# EAGLE schematic Radio Console-AS ORDERED 2015-05-06 (EAGLE 7.2.0)

## Sheet 1 of 4: Operators
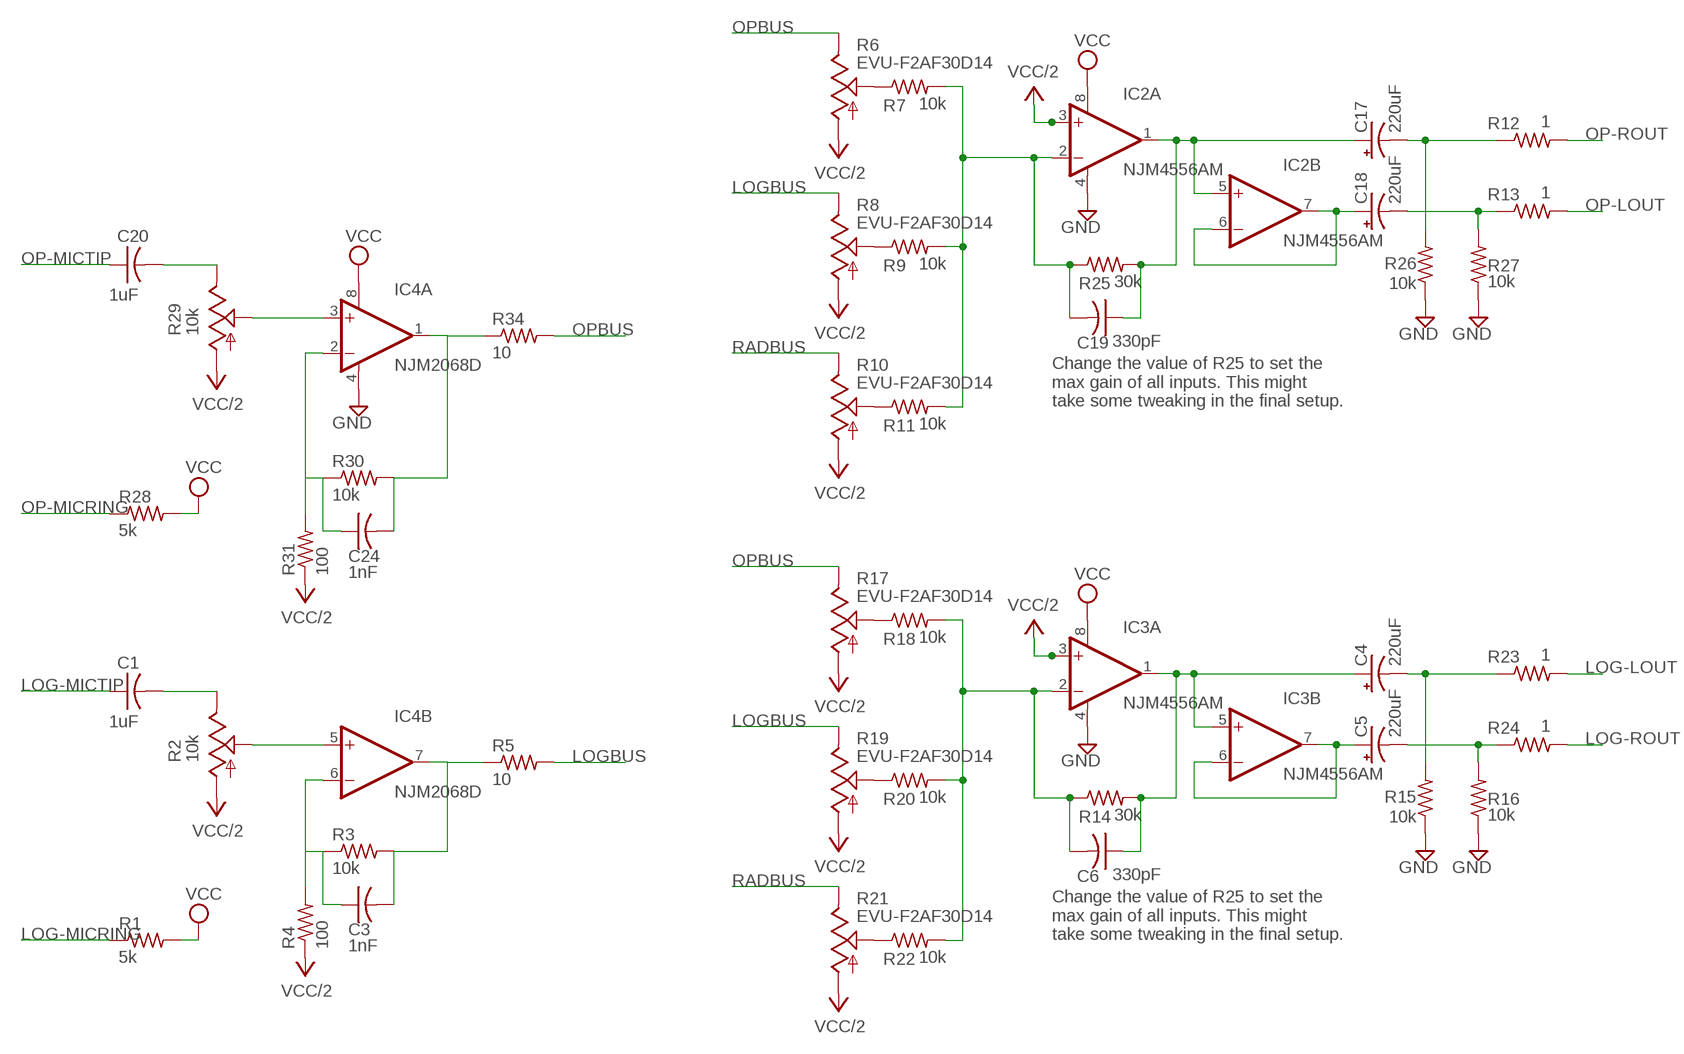
[diagram p0: schematic, sheet 1]

### Parts
C1  1uF  C-USC1206  [C1206]
C3  1nF  C-USC1206  [C1206]
C4  220uF  CPOL-USE5-8.5  [E5-8,5]
C5  220uF  CPOL-USE5-8.5  [E5-8,5]
C6  330pF  C-USC1206  [C1206]
C17  220uF  CPOL-USE5-8.5  [E5-8,5]
C18  220uF  CPOL-USE5-8.5  [E5-8,5]
C19  330pF  C-USC1206  [C1206]
C20  1uF  C-USC1206  [C1206]
C24  1nF  C-USC1206  [C1206]
IC2  NJM4556AM  OPA2131U  [SO08]
IC3  NJM4556AM  OPA2131U  [SO08]
IC4  NJM2068D  OPA2131U  [SO08]
R1  5k  R-US_R1206  [R1206]
R2  10k  TRIM_US-S64W  [S64W]
R3  10k  R-US_R1206  [R1206]
R4  100  R-US_R1206  [R1206]
R5  10  R-US_R1206  [R1206]
R6  EVU-F2AF30D14  US-EVUF2M  [EVUFXM]
R7  10k  R-US_R1206  [R1206]
R8  EVU-F2AF30D14  US-EVUF2M  [EVUFXM]
R9  10k  R-US_R1206  [R1206]
R10  EVU-F2AF30D14  US-EVUF2M  [EVUFXM]
R11  10k  R-US_R1206  [R1206]
R12  1  R-US_R1206  [R1206]
R13  1  R-US_R1206  [R1206]
R14  30k  R-US_R1206  [R1206]
R15  10k  R-US_R1206  [R1206]
R16  10k  R-US_R1206  [R1206]
R17  EVU-F2AF30D14  US-EVUF2M  [EVUFXM]
R18  10k  R-US_R1206  [R1206]
R19  EVU-F2AF30D14  US-EVUF2M  [EVUFXM]
R20  10k  R-US_R1206  [R1206]
R21  EVU-F2AF30D14  US-EVUF2M  [EVUFXM]
R22  10k  R-US_R1206  [R1206]
R23  1  R-US_R1206  [R1206]
R24  1  R-US_R1206  [R1206]
R25  30k  R-US_R1206  [R1206]
R26  10k  R-US_R1206  [R1206]
R27  10k  R-US_R1206  [R1206]
R28  5k  R-US_R1206  [R1206]
R29  10k  TRIM_US-S64W  [S64W]
R30  10k  R-US_R1206  [R1206]
R31  100  R-US_R1206  [R1206]
R34  10  R-US_R1206  [R1206]

### Nets
GND: IC2.4(A:V-) IC3.4(A:V-) IC4.4(A:V-) R15.1 R16.1 R26.1 R27.1 ; also sheet 2,3,4
LOG-LOUT: R23.2 ; also sheet 2
LOG-MICRING: R1.1 ; also sheet 2
LOG-MICTIP: C1.1 ; also sheet 2
LOG-ROUT: R24.2 ; also sheet 2
LOGBUS: R5.2 R8.3(E) R19.3(E) ; also sheet 3,4
N$1: C1.2 R2.E
N$2: IC4.5(B:+IN) R2.S
N$3: C3.1 IC4.6(B:-IN) R3.1 R4.2
N$4: C3.2 IC4.7(B:OUT) R3.2 R5.1
N$6: R6.2(S) R7.1
N$7: R8.2(S) R9.1
N$8: R10.2(S) R11.1
N$9: C17.- R12.1 R26.2
N$10: C18.- R13.1 R27.2
N$11: C6.2 IC3.2(A:-IN) R14.1 R18.2 R20.2 R22.2
N$13: C19.2 IC2.2(A:-IN) R7.2 R9.2 R11.2 R25.1
N$15: R17.2(S) R18.1
N$16: R19.2(S) R20.1
N$17: C20.2 R29.E
N$18: R21.2(S) R22.1
N$19: C4.- R15.2 R23.1
N$20: C5.- R16.2 R24.1
N$29: C24.1 IC4.2(A:-IN) R30.1 R31.2
N$30: C24.2 IC4.1(A:OUT) R30.2 R34.1
N$45: C4.+ C6.1 IC3.1(A:OUT) IC3.5(B:+IN) R14.2
N$46: C17.+ C19.1 IC2.1(A:OUT) IC2.5(B:+IN) R25.2
N$48: C18.+ IC2.6(B:-IN) IC2.7(B:OUT)
N$52: C5.+ IC3.6(B:-IN) IC3.7(B:OUT)
N$62: IC4.3(A:+IN) R29.S
OP-LOUT: R13.2 ; also sheet 2
OP-MICRING: R28.1 ; also sheet 2
OP-MICTIP: C20.1 ; also sheet 2
OP-ROUT: R12.2 ; also sheet 2
OPBUS: R6.3(E) R17.3(E) R34.2 ; also sheet 3,4
RADBUS: R10.3(E) R21.3(E) ; also sheet 3,4
VCC: IC2.8(A:V+) IC3.8(A:V+) IC4.8(A:V+) R1.2 R28.2 ; also sheet 2,3,4
VCC/2: IC2.3(A:+IN) IC3.3(A:+IN) R2.A R4.1 R6.1(A) R8.1(A) R10.1(A) R17.1(A) R19.1(A) R21.1(A) R29.A R31.1 ; also sheet 2,3,4

### Notes on the sheet
- Change the value of R25 to set the
  max gain of all inputs. This might 
  take some tweaking in the final setup.
- Change the value of R25 to set the
  max gain of all inputs. This might 
  take some tweaking in the final setup.

## Sheet 2 of 4: Connectors
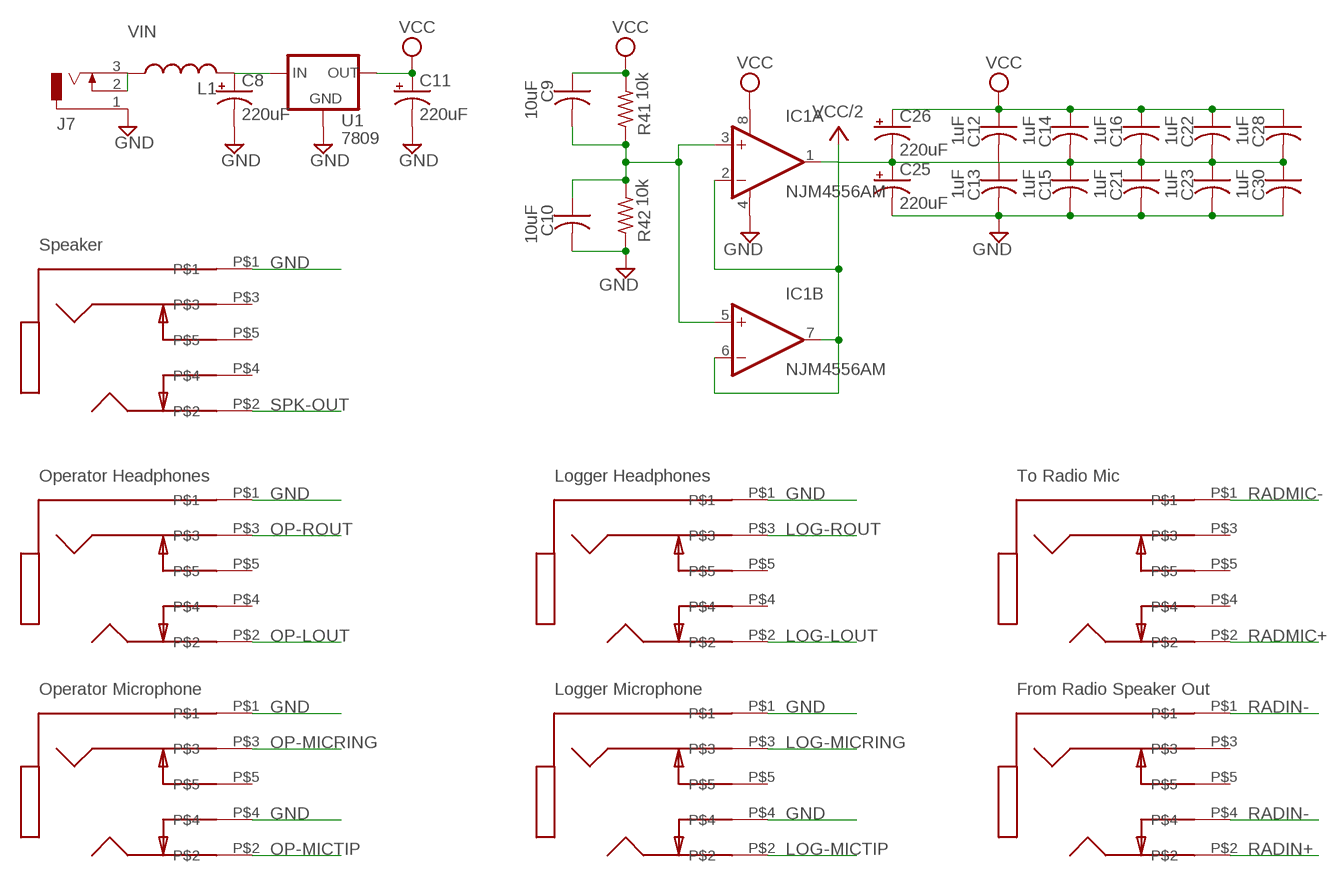
[diagram p1: schematic, sheet 2]

### Parts
C8  220uF  CPOL-USE5-8.5  [E5-8,5]
C9  10uF  C-USC1206  [C1206]
C10  10uF  C-USC1206  [C1206]
C11  220uF  CPOL-USE5-8.5  [E5-8,5]
C12  1uF  C-USC1206  [C1206]
C13  1uF  C-USC1206  [C1206]
C14  1uF  C-USC1206  [C1206]
C15  1uF  C-USC1206  [C1206]
C16  1uF  C-USC1206  [C1206]
C21  1uF  C-USC1206  [C1206]
C22  1uF  C-USC1206  [C1206]
C23  1uF  C-USC1206  [C1206]
C25  220uF  CPOL-USE5-8.5  [E5-8,5]
C26  220uF  CPOL-USE5-8.5  [E5-8,5]
C28  1uF  C-USC1206  [C1206]
C30  1uF  C-USC1206  [C1206]
IC1  NJM4556AM  OPA2131U  [SO08]
J1  Operator Headphones  SJ1-353  [SJ1-353]
J2  Operator Microphone  SJ1-353  [SJ1-353]
J3  To Radio MIcrophone  SJ1-353  [SJ1-353]
J4  Logger Headphone  SJ1-353  [SJ1-353]
J5  Logger Microphone  SJ1-353  [SJ1-353]
J6  From Radio Speaker Out  SJ1-353  [SJ1-353]
J7  DCJ0303  [DCJ0303]
J8  Operator Headphones  SJ1-353  [SJ1-353]
L1  L-USL4035M  [L4035M]
R41  10k  R-US_R1206  [R1206]
R42  10k  R-US_R1206  [R1206]
U1  7809  78XX-TO263  [D2PACK]

### Nets
GND: C8.- C10.2 C11.- C13.2 C15.2 C21.2 C23.2 C25.- C30.2 IC1.4(A:V-) J1.P$1 J2.P$1 J2.P$4 J4.P$1 J5.P$1 J5.P$4 J7.1 J8.P$1 R42.1 U1.2(GND) ; also sheet 1,3,4
LOG-LOUT: J4.P$2 ; also sheet 1
LOG-MICRING: J5.P$3 ; also sheet 1
LOG-MICTIP: J5.P$2 ; also sheet 1
LOG-ROUT: J4.P$3 ; also sheet 1
N$34: C9.2 C10.1 IC1.3(A:+IN) IC1.5(B:+IN) R41.1 R42.2
N$42: C8.+ L1.2 U1.1(IN)
OP-LOUT: J1.P$2 ; also sheet 1
OP-MICRING: J2.P$3 ; also sheet 1
OP-MICTIP: J2.P$2 ; also sheet 1
OP-ROUT: J1.P$3 ; also sheet 1
RADIN+: J6.P$2 ; also sheet 4
RADIN-: J6.P$1 J6.P$4 ; also sheet 4
RADMIC+: J3.P$2 ; also sheet 4
RADMIC-: J3.P$1 ; also sheet 4
SPK-OUT: J8.P$2 ; also sheet 4
VCC: C9.1 C11.+ C12.1 C14.1 C16.1 C22.1 C26.+ C28.1 IC1.8(A:V+) R41.2 U1.3(OUT) ; also sheet 1,3,4
VCC/2: C12.2 C13.1 C14.2 C15.1 C16.2 C21.1 C22.2 C23.1 C25.+ C26.- C28.2 C30.1 IC1.1(A:OUT) IC1.2(A:-IN) IC1.6(B:-IN) IC1.7(B:OUT) ; also sheet 1,3,4
VIN: J7.2 J7.3 L1.1
Unconnected: J1.P$4 J1.P$5 J2.P$5 J3.P$3 J3.P$4 J3.P$5 J4.P$4 J4.P$5 J5.P$5 J6.P$3 J6.P$5 J8.P$3 J8.P$4 J8.P$5

### Notes on the sheet
- Speaker
- Operator Headphones | Logger Headphones | To Radio Mic
- Operator Microphone | Logger Microphone | From Radio Speaker Out

## Sheet 3 of 4: VU Meters
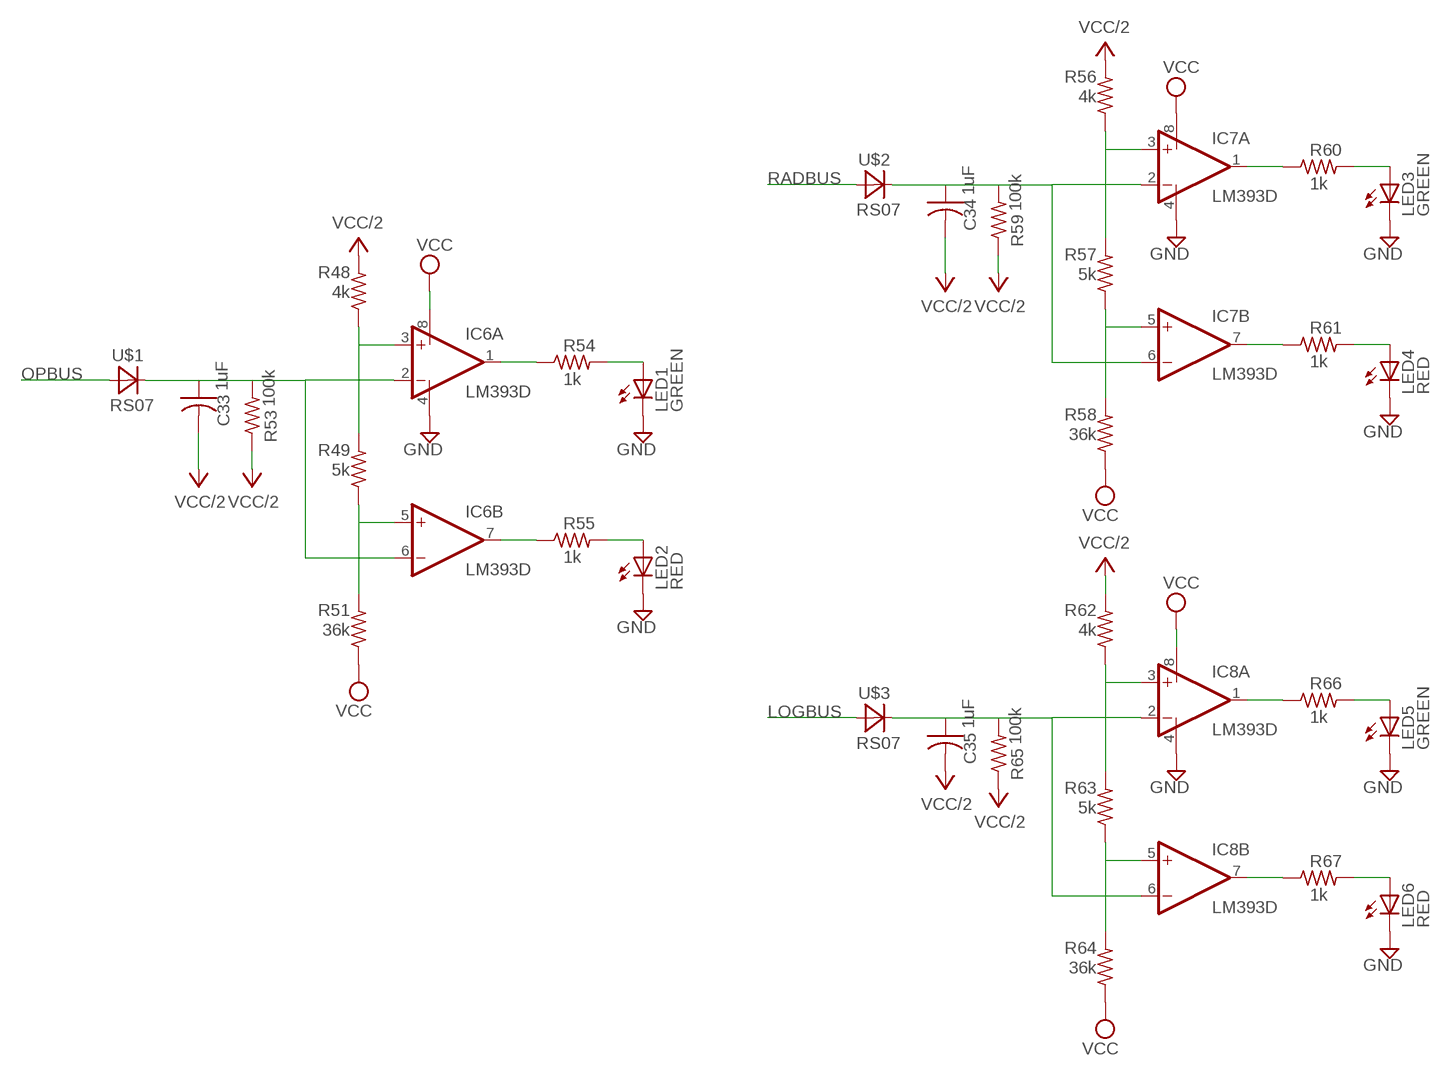
[diagram p2: schematic, sheet 3]

### Parts
C33  1uF  C-USC1206  [C1206]
C34  1uF  C-USC1206  [C1206]
C35  1uF  C-USC1206  [C1206]
IC6  LM393D  [SO08]
IC7  LM393D  [SO08]
IC8  LM393D  [SO08]
LED1  GREEN  LED3MM  [LED3MM]
LED2  RED  LED3MM  [LED3MM]
LED3  GREEN  LED3MM  [LED3MM]
LED4  RED  LED3MM  [LED3MM]
LED5  GREEN  LED3MM  [LED3MM]
LED6  RED  LED3MM  [LED3MM]
R48  4k  R-US_R1206  [R1206]
R49  5k  R-US_R1206  [R1206]
R51  36k  R-US_R1206  [R1206]
R53  100k  R-US_R1206  [R1206]
R54  1k  R-US_R1206  [R1206]
R55  1k  R-US_R1206  [R1206]
R56  4k  R-US_R1206  [R1206]
R57  5k  R-US_R1206  [R1206]
R58  36k  R-US_R1206  [R1206]
R59  100k  R-US_R1206  [R1206]
R60  1k  R-US_R1206  [R1206]
R61  1k  R-US_R1206  [R1206]
R62  4k  R-US_R1206  [R1206]
R63  5k  R-US_R1206  [R1206]
R64  36k  R-US_R1206  [R1206]
R65  100k  R-US_R1206  [R1206]
R66  1k  R-US_R1206  [R1206]
R67  1k  R-US_R1206  [R1206]
U$1  RS07  [DO-219AB]
U$2  RS07  [DO-219AB]
U$3  RS07  [DO-219AB]

### Nets
GND: IC6.4(P:V-) IC7.4(P:V-) IC8.4(P:V-) LED1.K(C) LED2.K(C) LED3.K(C) LED4.K(C) LED5.K(C) LED6.K(C) ; also sheet 1,2,4
LOGBUS: U$3.ANODE(A) ; also sheet 1,4
N$96: IC6.3(A:+IN) R48.1 R49.2
N$97: IC6.5(B:+IN) R49.1 R51.2
N$98: C33.1 IC6.2(A:-IN) IC6.6(B:-IN) R53.2 U$1.CATHODE(C)
N$99: IC6.1(A:OUT) R54.1
N$100: IC6.7(B:OUT) R55.1
N$101: LED1.A R54.2
N$102: LED2.A R55.2
N$103: IC7.3(A:+IN) R56.1 R57.2
N$104: IC7.5(B:+IN) R57.1 R58.2
N$105: C34.1 IC7.2(A:-IN) IC7.6(B:-IN) R59.2 U$2.CATHODE(C)
N$106: IC7.1(A:OUT) R60.1
N$107: IC7.7(B:OUT) R61.1
N$108: LED3.A R60.2
N$109: LED4.A R61.2
N$110: IC8.3(A:+IN) R62.1 R63.2
N$111: IC8.5(B:+IN) R63.1 R64.2
N$112: C35.1 IC8.2(A:-IN) IC8.6(B:-IN) R65.2 U$3.CATHODE(C)
N$113: IC8.1(A:OUT) R66.1
N$114: IC8.7(B:OUT) R67.1
N$115: LED5.A R66.2
N$116: LED6.A R67.2
OPBUS: U$1.ANODE(A) ; also sheet 1,4
RADBUS: U$2.ANODE(A) ; also sheet 1,4
VCC: IC6.8(P:V+) IC7.8(P:V+) IC8.8(P:V+) R51.1 R58.1 R64.1 ; also sheet 1,2,4
VCC/2: C33.2 C34.2 C35.2 R48.2 R53.1 R56.2 R59.1 R62.2 R65.1 ; also sheet 1,2,4

## Sheet 4 of 4: Radio
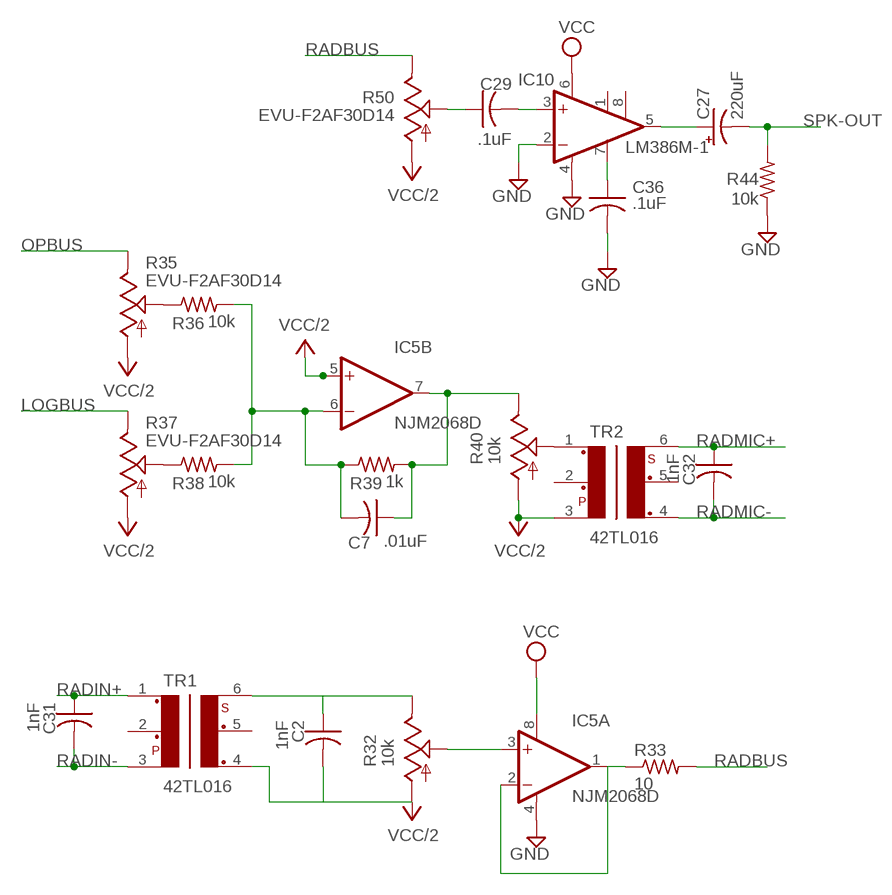
[diagram p3: schematic, sheet 4]

### Parts
C2  1nF  C-USC1206  [C1206]
C7  .01uF  C-USC1206  [C1206]
C27  220uF  CPOL-USE5-8.5  [E5-8,5]
C29  .1uF  C-USC1206  [C1206]
C31  1nF  C-USC1206  [C1206]
C32  1nF  C-USC1206  [C1206]
C36  .1uF  C-USC1206  [C1206]
IC5  NJM2068D  OPA2131U  [SO08]
IC10  LM386M-1  [SO08]
R32  10k  TRIM_US-S64W  [S64W]
R33  10  R-US_R1206  [R1206]
R35  EVU-F2AF30D14  US-EVUF2M  [EVUFXM]
R36  10k  R-US_R1206  [R1206]
R37  EVU-F2AF30D14  US-EVUF2M  [EVUFXM]
R38  10k  R-US_R1206  [R1206]
R39  1k  R-US_R1206  [R1206]
R40  10k  TRIM_US-S64W  [S64W]
R44  10k  R-US_R1206  [R1206]
R50  EVU-F2AF30D14  US-EVUF2M  [EVUFXM]
TR1  42TL016  [42TL]
TR2  42TL016  [42TL]

### Nets
GND: C36.2 IC5.4(A:V-) IC10.2(-IN) IC10.4(GND) R44.1 ; also sheet 1,2,3
LOGBUS: R37.3(E) ; also sheet 1,3
N$5: C2.1 R32.E TR1.6
N$21: IC5.3(A:+IN) R32.S
N$22: IC5.1(A:OUT) IC5.2(A:-IN) R33.1
N$23: C7.2 IC5.6(B:-IN) R36.2 R38.2 R39.1
N$24: R35.2(S) R36.1
N$25: R37.2(S) R38.1
N$38: C29.2 IC10.3(+IN)
N$40: C36.1 IC10.7(BYPASS)
N$41: C29.1 R50.2(S)
N$67: C27.+ IC10.5(OUT)
N$73: R40.S TR2.1
N$81: C7.1 IC5.7(B:OUT) R39.2 R40.E
OPBUS: R35.3(E) ; also sheet 1,3
RADBUS: R33.2 R50.3(E) ; also sheet 1,3
RADIN+: C31.1 TR1.1 ; also sheet 2
RADIN-: C31.2 TR1.3 ; also sheet 2
RADMIC+: C32.1 TR2.6 ; also sheet 2
RADMIC-: C32.2 TR2.4 ; also sheet 2
SPK-OUT: C27.- R44.2 ; also sheet 2
VCC: IC5.8(A:V+) IC10.6(VS) ; also sheet 1,2,3
VCC/2: C2.2 IC5.5(B:+IN) R32.A R35.1(A) R37.1(A) R40.A R50.1(A) TR1.4 TR2.3 ; also sheet 1,2,3
Unconnected: IC10.1(GAIN) IC10.8(GAIN) TR1.2 TR1.5 TR2.2 TR2.5

## Library data of the parts
C1-C3 C6 C7 C9 C10 C12-C16 C19-C24 C28-C36 = resistor:C-US: CAPACITOR, American symbol
C4 C5 C8 C11 C17 C18 C25-C27 = resistor:CPOL-US: POLARIZED CAPACITOR, American symbol
IC1-IC5 = burr-brown:OPA2131: General Purpose FET-Input Operational Amplifiers Product Folder:OPA2131; MF: TEXAS INSTRUMENT CONNECTORS; MPN: OPA2131UJ/2K5; OC_FARNELL: 1575488; OC_NEWARK: 75C4620
IC6-IC8 = linear:LM393: COMPARATOR
IC10 = linear:LM386?-*: Low Voltage Audio Power Amplifier Source: http://cache.national.com/ds/LM/LM386.pdf
J1-J6 J8 = con-cui:SJ1-353
J7 = con-jack:DCJ0303: DC POWER JACK Source: DCJ0303.pdf; OC_FARNELL: unknown; OC_NEWARK: unknown
L1 = resistor:L-US: INDUCTOR, American symbol
LED1-LED6 = led:LED: LED OSRAM: - CHIPLED LG R971, LG N971, LY N971, LG Q971, LY Q971, LO R971, LY R971 LH N974, LH R974 LS Q976, LO Q976, LY Q976 LO Q996 - Hyper CHIPLED LW Q18S LB Q993, LB Q99A, LB R99A - SideLED LS A670, LO A670, LY A670, LG A670, LP A670 LB A673, LV A673, LT A673, LW A673 LH A674 LY A675 LS A676, LA A676, LO A676, LY A676, LW A676 LS A679, LY A679, LG A679 - Hyper Micro SIDELED® LS Y876, LA Y876, LO Y876, LY Y876 LT Y87S - SmartLED LW L88C, LW L88S LB L89C, LB L89S, LG L890 LS L89K, LO L89K, LY L89K LS L896, LA L896, LO L896, LY L896 - TOPLED LS T670, LO T670, LY T670, LG T670, LP T670 LSG T670, LSP T670, LSY T670, LOP T670, LYG T670 LG T671, LOG T671, LSG T671 LB T673, LV T673, LT T673, LW T673 LH T674 LS T676, LA T676, LO T676, LY T676, LB T676, LH T676, LSB T676, LW T676 LB T67C, LV T67C, LT T67C, LS T67K, LO T67K, LY T67K, LW E67C LS E67B, LA E67B, LO E67B, LY E67B, LB E67C, LV E67C, LT E67C LW T67C LS T679, LY T679, LG T679 LS T770, LO T770, LY T770, LG T770, LP T770 LB T773, LV T773, LT T773, LW T773 LH T774 LS E675, LA E675, LY E675, LS T675 LS T776, LA T776, LO T776, LY T776, LB T776 LHGB T686 LT T68C, LB T68C - Hyper Mini TOPLED® LB M676 - Mini TOPLED Santana® LG M470 LS M47K, LO M47K, LY M47K Source: http://www.osram.convergy.de LUXEON: - LUMILED® LXK2-PW12-R00, LXK2-PW12-S00, LXK2-PW14-U00, LXK2-PW14-V00 LXK2-PM12-R00, LXK2-PM12-S00, LXK2-PM14-U00 LXK2-PE12-Q00, LXK2-PE12-R00, LXK2-PE12-S00, LXK2-PE14-T00, LXK2-PE14-U00 LXK2-PB12-K00, LXK2-PB12-L00, LXK2-PB12-M00, LXK2-PB14-N00, LXK2-PB14-P00, LXK2-PB14-Q00 LXK2-PR12-L00, LXK2-PR12-M00, LXK2-PR14-Q00, LXK2-PR14-R00 LXK2-PD12-Q00, LXK2-PD12-R00, LXK2-PD12-S00 LXK2-PH12-R00, LXK2-PH12-S00 LXK2-PL12-P00, LXK2-PL12-Q00, LXK2-PL12-R00 Source: www.luxeon.com KINGBRIGHT: KA-3528ASYC Source: www.kingbright.com
R1 R3-R5 R7 R9 R11-R16 R18 R20 R22-R28 R30 R31 R33 R34 R36 R38 R39 R41 R42 R44 R48 R49 R51 R53-R67 = resistor:R-US_: RESISTOR, American symbol
R2 R29 R32 R40 = pot:TRIM_US-: POTENTIOMETER
R6 R8 R10 R17 R19 R21 R35 R37 R50 = pot:US-EVU: 9 mm Square Rotary Potentiometers Source: Panasonic
TR1 TR2 = trafo-xicon:42T?*: Xicon Micro-Mini EI-12 Audio Transformers 42TL/42TC/42TM Series Source: http://www.mouser.com//catalog/specsheets/164201.pdf http://www.mouser.com/catalog/specsheets/114225.pdf http://www.mouser.com/catalog/specsheets/164267.pdf; OC_FARNELL: unknown; OC_NEWARK: unknown
U1 = v-reg:78XX-TO263
U$1-U$3 = diode:RS07*